# Altium schematic sheet buffer.SchDoc
size A4; SheetNumber: 5; SheetTotal: 5
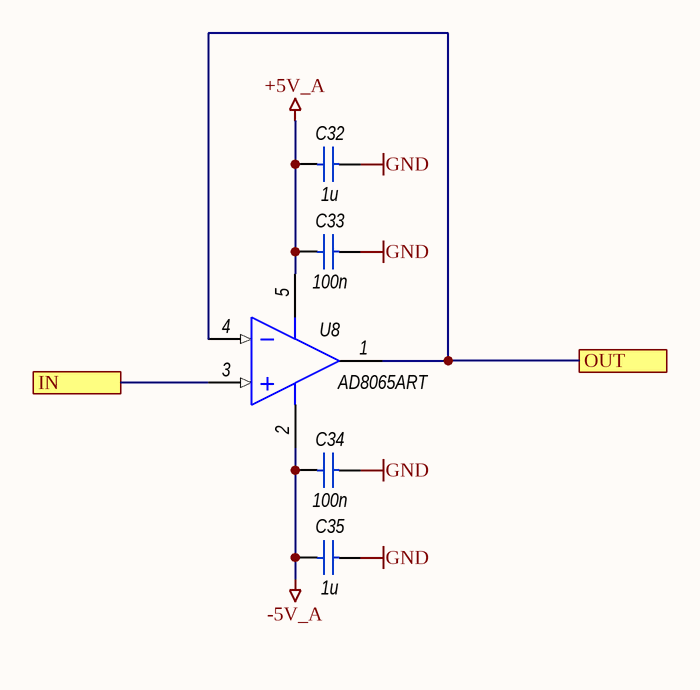
[diagram p0: buffer.SchDoc]

## Parts
C32  1u  [CAP_0603]
C33  100n  [CAP_0603]
C34  100n  [CAP_0603]
C35  1u  [CAP_0603]
U8  AD8065ART  [sot235]

## Ports
IN, OUT

## Nets
+5V_A: C32.1 C33.1 U8.5(V+)
-5V_A: C34.1 C35.1 U8.2(V-)
GND: C32.2 C33.2 C34.2 C35.2
IN: U8.3(IN+) ; port IN
OUT: U8.1(OUT) U8.4(IN-) ; port OUT

## Library data of the parts
C32-C35 = Capacitor: Конденсатор
U8 = OPAMP SOT235: Операционный усилитель